# Altium project miniquad-m3.PrjPcb
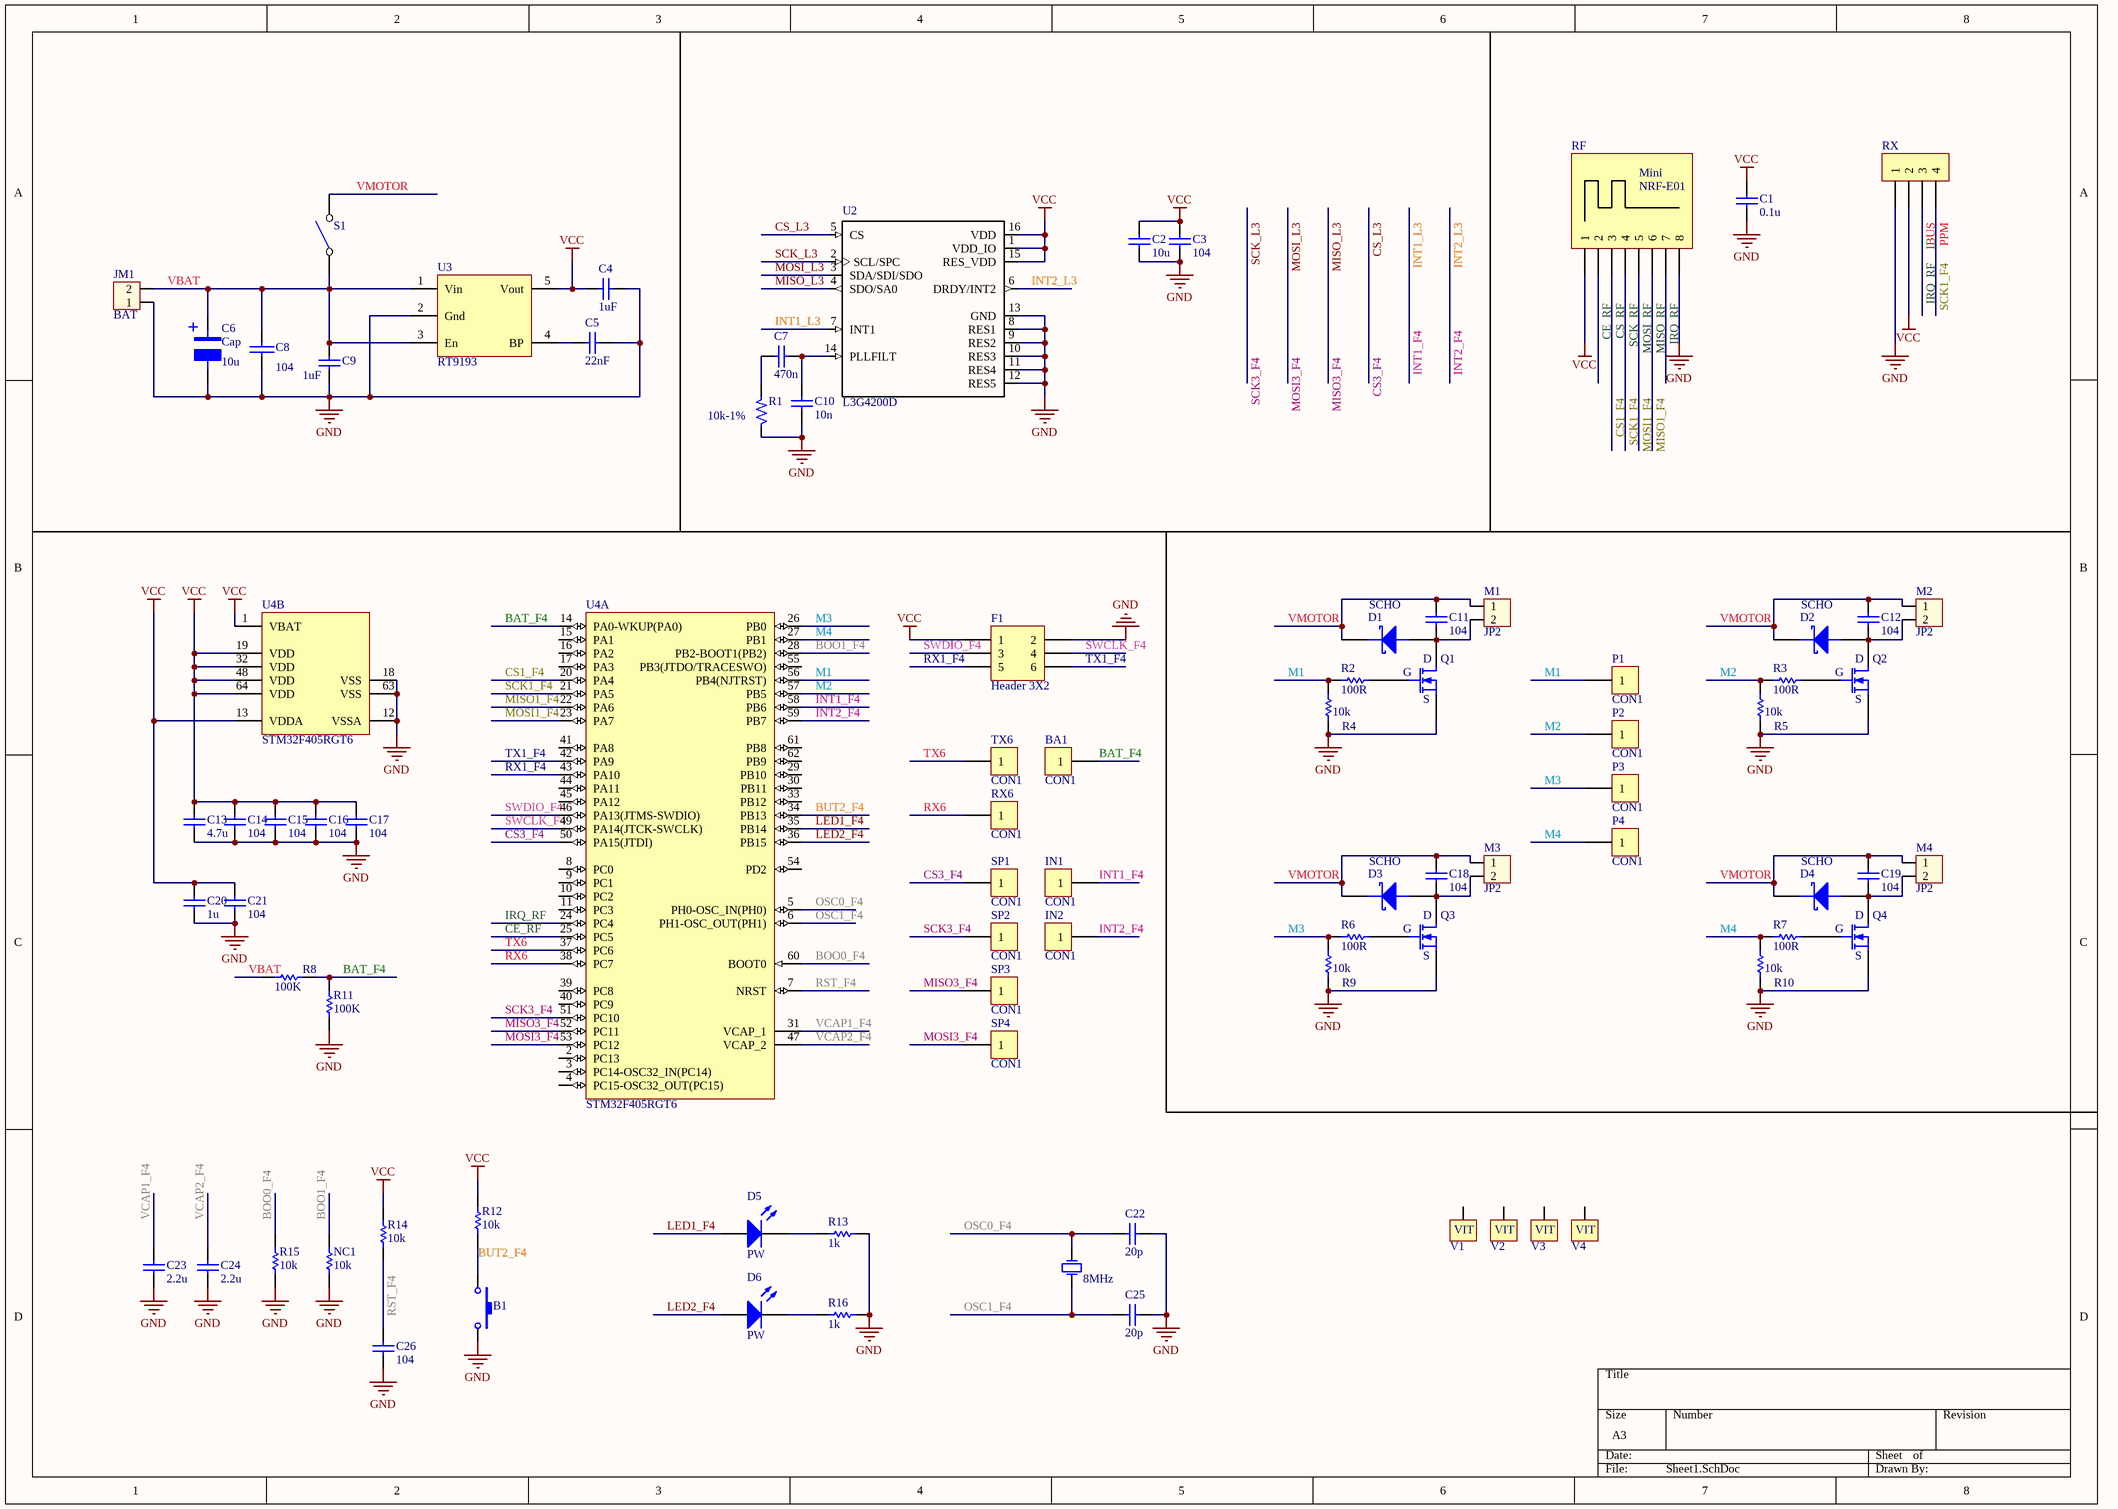
[diagram p0: Sheet1.SchDoc]
1 sheet, 84 parts. Net scope: global (net labels, ports and power ports of the same name join across sheets).
Board file: PCB1.PcbDoc

## Sheet Sheet1.SchDoc: miniquad-main
size A3; Author: thanhbinh89; DrawnBy: thanhbinh89; Engineer: thanhbinh89; Revision: 3

### Parts
B1  SW-SMD  [SW-SMD]  (value not drawn)
BA1  CON1  [TEST-POINT]
C1  value 0.1u  [Cap-0603]  (hidden comment: Cap)
C2  value 10u  [Cap-0603]  (hidden comment: Cap)
C3  value 104  [Cap-0603]  (hidden comment: Cap)
C4  value 1uF  [Cap-0603]  (hidden comment: Cap)
C5  value 22nF  [Cap-0603]  (hidden comment: Cap)
C6  Cap  value 10u  [SMT_C_Tantalum_B]
C7  value 470n  [Cap-0603]  (hidden comment: Cap)
C8  value 104  [Cap-0603]  (hidden comment: Cap)
C9  value 1uF  [Cap-0603]  (hidden comment: Cap)
C10  value 10n  [Cap-0603]  (hidden comment: Cap)
C11  value 104  [Cap-0603]  (hidden comment: Cap)
C12  value 104  [Cap-0603]  (hidden comment: Cap)
C13  value 4.7u  [Cap-0603]  (hidden comment: Cap)
C14  value 104  [Cap-0603]  (hidden comment: Cap)
C15  value 104  [Cap-0603]  (hidden comment: Cap)
C16  value 104  [Cap-0603]  (hidden comment: Cap)
C17  value 104  [Cap-0603]  (hidden comment: Cap)
C18  value 104  [Cap-0603]  (hidden comment: Cap)
C19  value 104  [Cap-0603]  (hidden comment: Cap)
C20  value 1u  [Cap-0603]  (hidden comment: Cap)
C21  value 104  [Cap-0603]  (hidden comment: Cap)
C22  value 20p  [Cap-0603]  (hidden comment: Cap)
C23  value 2.2u  [Cap-0603]  (hidden comment: Cap)
C24  value 2.2u  [Cap-0603]  (hidden comment: Cap)
C25  value 20p  [Cap-0603]  (hidden comment: Cap)
C26  value 104  [Cap-0603]  (hidden comment: Cap)
D1  SCHO  [SMA]
D2  SCHO  [SMA]
D3  SCHO  [SMA]
D4  SCHO  [SMA]
D5  PW  [LED_SMD_0805_GREEN]
D6  PW  [LED_SMD_0805_RED]
F1  Header 3X2  [HDR2X3]
IN1  CON1  [TEST-POINT]
IN2  CON1  [TEST-POINT]
JM1  BAT  [jp2h]
M1  JP2  [Con2 - 1.27MM]
M2  JP2  [Con2 - 1.27MM]
M3  JP2  [Con2 - 1.27MM]
M4  JP2  [Con2 - 1.27MM]
NC1  value 10k  [RES-SMD-0603]  (hidden comment: Resistor)
P1  CON1  [TEST-POINT]
P2  CON1  [TEST-POINT]
P3  CON1  [TEST-POINT]
P4  CON1  [TEST-POINT]
Q1  Si2302DS  [SOT23-3]  (value not drawn)
Q2  Si2302DS  [SOT23-3]  (value not drawn)
Q3  Si2302DS  [SOT23-3]  (value not drawn)
Q4  Si2302DS  [SOT23-3]  (value not drawn)
R1  10k-1%  [RES-SMD-0603]
R2  value 100R  [RES-SMD-0603]  (hidden comment: Resistor)
R3  value 100R  [RES-SMD-0603]  (hidden comment: Resistor)
R4  value 10k  [RES-SMD-0603]  (hidden comment: Resistor)
R5  value 10k  [RES-SMD-0603]  (hidden comment: Resistor)
R6  value 100R  [RES-SMD-0603]  (hidden comment: Resistor)
R7  value 100R  [RES-SMD-0603]  (hidden comment: Resistor)
R8  value 100K  [RES-SMD-0603]  (hidden comment: Resistor)
R9  value 10k  [RES-SMD-0603]  (hidden comment: Resistor)
R10  value 10k  [RES-SMD-0603]  (hidden comment: Resistor)
R11  value 100K  [RES-SMD-0603]  (hidden comment: Resistor)
R12  value 10k  [RES-SMD-0603]  (hidden comment: Resistor)
R13  value 1k  [RES-SMD-0603]  (hidden comment: Resistor)
R14  value 10k  [RES-SMD-0603]  (hidden comment: Resistor)
R15  value 10k  [RES-SMD-0603]  (hidden comment: Resistor)
R16  value 1k  [RES-SMD-0603]  (hidden comment: Resistor)
RF  nRF24l01  [NRF-E01]  (value not drawn)
RX  CON4  [SH4-1MM]  (value not drawn)
RX6  CON1  [TEST-POINT]
S1  SW SPST  [SW1-SMD]  (value not drawn)
SP1  CON1  [TEST-POINT]
SP2  CON1  [TEST-POINT]
SP3  CON1  [TEST-POINT]
SP4  CON1  [TEST-POINT]
TX6  CON1  [TEST-POINT]
U2  L3G4200D  [*PQFN65P400X400X110N]
U3  RT9193  [RT9193]
U4  STM32F405RGT6  [STM-LQFP64_L]  (parts A,B of 2)
V1  1  [vit-2mm]  (value not drawn)
V2  1  [vit-2mm]  (value not drawn)
V3  1  [vit-2mm]  (value not drawn)
V4  1  [vit-2mm]  (value not drawn)
Y1  8MHz  [CRY_SMD_5032]

### Nets
GND: B1.2 C1.1 C2.1 C3.1 C4.1 C5.1 C6.2 C8.2 C9.2 C10.1 C13.1 C14.1 C15.1 C16.1 C17.1 C20.1 C21.1 C22.1 C23.1 C24.1 C25.1 C26.1 F1.2 JM1.1 NC1.1 Q1.2(S) Q2.2(S) Q3.2(S) Q4.2(S) R1.1 R4.2 R5.2 R9.2 R10.2 R11.1 R13.2 R15.1 R16.2 RF.8 RX.1 U2.8(RES1) U2.9(RES2) U2.10(RES3) U2.11(RES4) U2.12(RES5) U2.13(GND) U3.2(Gnd) U4.12(VSSA) U4.18(VSS) U4.63(VSS)
VCC: C1.2 C2.2 C3.2 C4.2 C13.2 C14.2 C15.2 C16.2 C17.2 C20.2 C21.2 F1.1 R12.2 R14.2 RF.1 RX.2 U2.1(VDD_IO) U2.15(RES_VDD) U2.16(VDD) U3.5(Vout) U4.1(VBAT) U4.13(VDDA) U4.19(VDD) U4.32(VDD) U4.48(VDD) U4.64(VDD)
BAT_F4: BA1.1 R8.2 R11.2 U4.14(PA0-WKUP(PA0))
BOO0_F4: R15.2 U4.60(BOOT0)
BOO1_F4: NC1.2 U4.28(PB2-BOOT1(PB2))
BUT2_F4: B1.1 R12.1 U4.34(PB13)
CE_RF: RF.2 U4.25(PC5)
CS1_F4: RF.3 U4.20(PA4)  [also labelled CS_RF]
CS3_F4: SP1.1 U2.5(CS) U4.50(PA15(JTDI))  [also labelled CS_L3]
IBUS: RF.7 RX.3 U4.24(PC4)  [also labelled IRQ_RF]
INT1_F4: IN1.1 U2.7(INT1) U4.58(PB6)  [also labelled INT1_L3]
INT2_F4: IN2.1 U2.6(DRDY/INT2) U4.59(PB7)  [also labelled INT2_L3]
LED1_F4: D5.1(A) U4.35(PB14)
LED2_F4: D6.1(A) U4.36(PB15)
M1: P1.1 R2.2 R4.1 U4.56(PB4(NJTRST))
M2: P2.1 R3.2 R5.1 U4.57(PB5)
M3: P3.1 R6.2 R9.1 U4.26(PB0)
M4: P4.1 R7.2 R10.1 U4.27(PB1)
MISO1_F4: RF.6 U4.22(PA6)  [also labelled MISO_RF]
MISO3_F4: SP3.1 U2.4(SDO/SA0) U4.52(PC11)  [also labelled MISO_L3]
MOSI1_F4: RF.5 U4.23(PA7)  [also labelled MOSI_RF]
MOSI3_F4: SP4.1 U2.3(SDA/SDI/SDO) U4.53(PC12)  [also labelled MOSI_L3]
OSC0_F4: C22.2 U4.5(PH0-OSC_IN(PH0)) Y1.2(OSC2)
OSC1_F4: C25.2 U4.6(PH1-OSC_OUT(PH1)) Y1.1(OSC1)
PPM: RF.4 RX.4 U4.21(PA5)  [also labelled SCK1_F4, SCK_RF]
RST_F4: C26.2 R14.1 U4.7(NRST)
RX1_F4: F1.5 U4.43(PA10)
RX6: RX6.1 U4.38(PC7)
SCK3_F4: SP2.1 U2.2(SCL/SPC) U4.51(PC10)  [also labelled SCK_L3]
SWCLK_F4: F1.4 U4.49(PA14(JTCK-SWCLK))
SWDIO_F4: F1.3 U4.46(PA13(JTMS-SWDIO))
TX1_F4: F1.6 U4.42(PA9)
TX6: TX6.1 U4.37(PC6)
VBAT: C6.1 C8.1 C9.1 JM1.2 R8.1 S1.1(COMMON) U3.1(Vin) U3.3(En)
VCAP1_F4: C23.2 U4.31(VCAP_1)
VCAP2_F4: C24.2 U4.47(VCAP_2)
VMOTOR: C11.2 C12.2 C18.2 C19.2 D1.2(K) D2.2(K) D3.2(K) D4.2(K) M1.1 M2.1 M3.1 M4.1 S1.2(NO)
NetC5_2: C5.2 U3.4(BP)
NetC7_1: C7.1 R1.2
NetC7_2: C7.2 C10.2 U2.14(PLLFILT)
NetC11_1: C11.1 D1.1(A) M1.2 Q1.3(D)
NetC12_1: C12.1 D2.1(A) M2.2 Q2.3(D)
NetC18_1: C18.1 D3.1(A) M3.2 Q3.3(D)
NetC19_1: C19.1 D4.1(A) M4.2 Q4.3(D)
NetD5_2: D5.2(K) R13.1
NetD6_2: D6.2(K) R16.1
NetQ1_1: Q1.1(G) R2.1
NetQ2_1: Q2.1(G) R3.1
NetQ3_1: Q3.1(G) R6.1
NetQ4_1: Q4.1(G) R7.1

Not connected (* = marked no-connect by the designer): U4 2(PC13) 3(PC14-OSC32_IN(PC14)) 4(PC15-OSC32_OUT(PC15)) 8(PC0) 9(PC1) 10(PC2) 11(PC3) 15(PA1) 16(PA2) 17(PA3) 29(PB10) 30(PB11) 33(PB12) 39(PC8) 40(PC9) 41(PA8) 44(PA11) 45(PA12) 54(PD2) 55(PB3(JTDO/TRACESWO)) 61(PB8) 62(PB9); V1 VIT1(1); V2 VIT1(1); V3 VIT1(1); V4 VIT1(1)

### Notes on the sheet
- (in symbol Cap Pol) +
- (in symbol nRF24) Mini; NRF-E01

### Library data of the parts
B1 = SW-SMD: Switch; Published: 24-Mar-1999; LatestRevisionDate: 17-Jul-2002; LatestRevisionNote: Re-released for DXP Platform.; PackageReference: SPST-2; Publisher: Altium Limited
BA1 IN1 IN2 P1-P4 RX6 SP1-SP4 TX6 = CON1: Connector
C1-C5 C7-C26 = Cap: Capacitor
  C1-C5 C7 C9-C26: Published: 8-Jun-2000; LatestRevisionDate: 17-Jul-2002; LatestRevisionNote: Re-released for DXP Platform.; PackageReference: RAD-0.3; Publisher: Altium Limited
  C8: Footprint: *
C6 = Cap Pol
D1-D4 = DIODE SCHOTTKY: Schottky Diode
D5 D6 = LED: Typical INFRARED GaAs LED; Published: 8-Jun-2000; LatestRevisionDate: 08-Jul-2005; LatestRevisionNote: Mech Layer 1 removed.; PackageReference: LED-0; Publisher: Altium Limited
F1 = Header 3X2: Header, 3-Pin, Dual row; LatestRevisionDate: 17-Jul-2002; LatestRevisionNote: Re-released for DXP Platform.; Publisher: Altium Limited
JM1 M1-M4 = CON2: Connector 2; Value: Connector 2
NC1 R2-R16 = Resistor: Semiconductor Resistor; Published: 8-Jun-2000; LatestRevisionDate: 17-Jul-2002; LatestRevisionNote: Re-released for DXP Platform.; PackageReference: AXIAL-0.5; Publisher: Altium Limited
Q1-Q4 = Si2302DS: N-Channel MOSFET; Published: 8-Jun-2000; LatestRevisionDate: 17-Jul-2002; LatestRevisionNote: Re-released for DXP Platform.; PackageVersion: 1995/1996; PackageReference: E3; Publisher: Altium Limited; PackageDescription: TO, Flat Index; 3 In-Line, Axial Leads; Body Dia. 4.6mm; Lead Dia. 0.5 mm (max)
R1 = Res: Resistor 1/4W; Value: 10k-1%
RF = nRF24: LatestRevisionDate: 17-Jul-2002; LatestRevisionNote: Re-released for DXP Platform.; Publisher: Altium Limited
RX = CON4: Connector
U2 = L3G4200D: Gyroscope X _Pitch_, Y _Roll_, Z _Yaw_ Â±250, 500, 2000 100Hz ~ 800Hz IÂ²C, SPI 16-LGA _4x4_; MF: STMicroelectronics; SnapEDA_Link: https://www.snapeda.com/parts/L3G4200D/STMicroelectronics/view-part/237126/?ref=snap; Availability: Unavailable; Price: None; Package: TFLGA-16 STMicroelectronics; MP: L3G4200D; Value: *
U4 = STM32F405RGT6: ARM Cortex-M4 32-bit MCU+FPU, 210 DMIPS, 1024 kB Flash, 192 kB Internal RAM, 51 I/Os, 64-pin LQFP, -40 to 85 degC, Tray; Manufacturer: STMicroelectronics; D/A Converter: 2x12-bit; FLASH Size (Prog) (kB): 1024; I/Os (High Current): 51; Internal RAM Size (kB): 192; Operating Frequency(F) (Processor speed) (MHz): 168; Supply Voltage(Vcc) max (V): 3.6; Supply Voltage(Vcc) min (V): 1.8; DatasheetVersion: Rev. 4; PackageVersion: Rev. 4, 06/2013; PackageReference: LQFP64; PackageDescription: 64-Pin Low Profile Quad Flat Package, 10 x 10 mm Body, 0.5 mm Pitch; Supplier 1: Digi-Key; Supplier Part Number 1: 497-11767-ND; Supplier 2: Farnell; Supplier Part Number 2: 2064363; Supplier 3: Newark; Supplier Part Number 3: 73T2329; Supplier 4: Mouser; Supplier Part Number 4: 511-STM32F405RGT6; Core: ARM Cortex-M4; Packing: Tray; Mounting Technology: Surface Mount; PartNumber: STM32F405RGT6; ComponentLink1Description: Manufacturer URL; ComponentLink1URL: http://www.st.com/web/en/home.html; ComponentLink2Description: Datasheet; ComponentLink2URL: http://www.st.com/st-web-ui/static/active/en/resource/technical/document/datasheet/DM00037051.pdf; ComponentLink3Description: Package Specification; ComponentLink3URL: http://www.st.com/st-web-ui/static/active/en/resource/technical/document/datasheet/DM00037051.pdf
V1-V4 = VIT: Oc Vit
Y1 = Crystal: Crystal Oscillator; Published: 8-Jun-2000; LatestRevisionDate: 17-Jul-2002; LatestRevisionNote: Re-released for DXP Platform.; PackageReference: R38; Publisher: Altium Limited